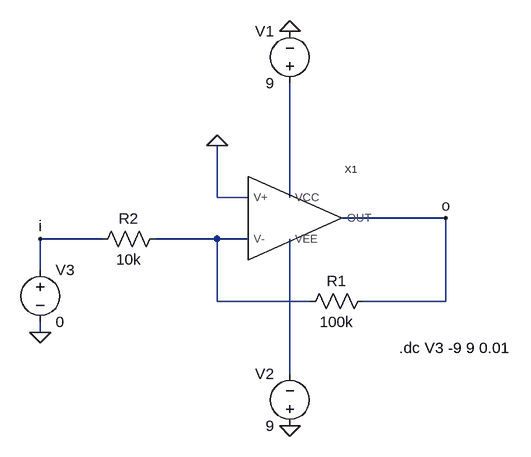
[diagram p0: schematic Output_Swing.asc]
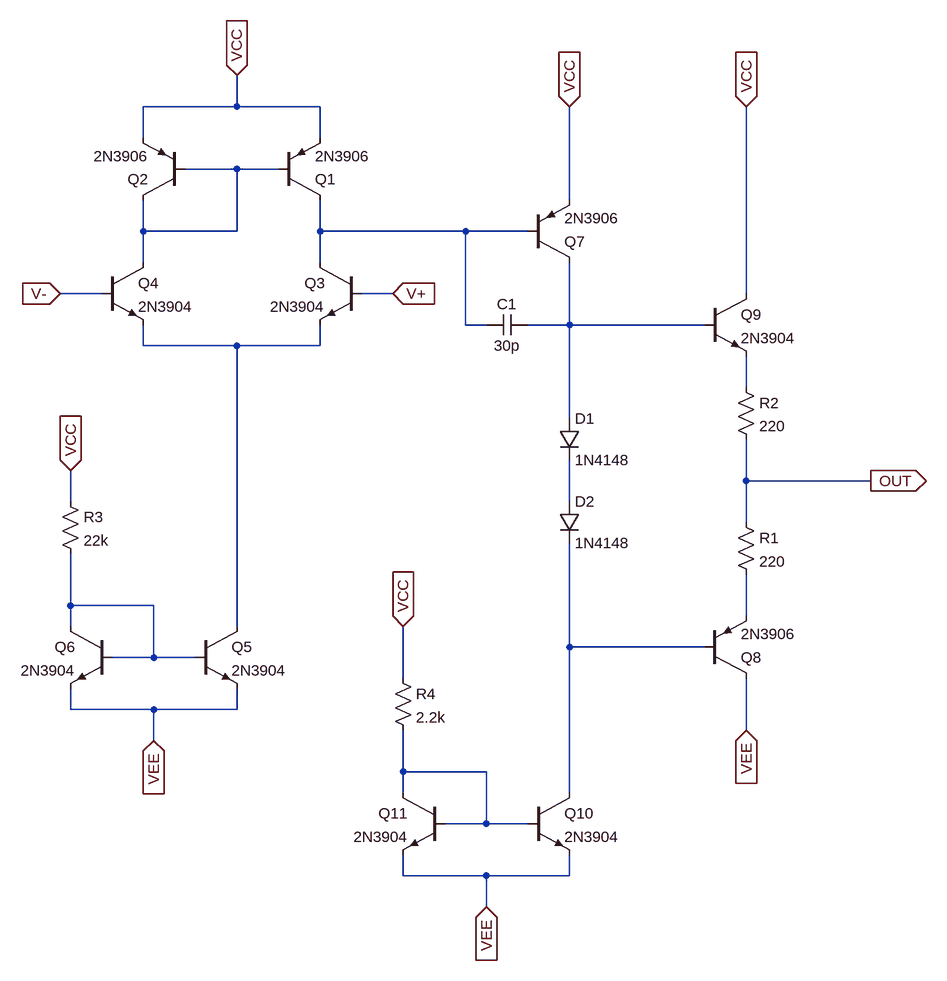
[diagram p1: sub-circuit giug_amp_301.asc]
Output_Swing.asc, the LTspice schematic file:
Version 4
SHEET 1 880 680
WIRE 128 112 128 32
WIRE 176 112 128 112
WIRE 240 112 240 -64
WIRE 480 144 320 144
WIRE -48 176 -144 176
WIRE 128 176 32 176
WIRE 176 176 128 176
WIRE -144 224 -144 176
WIRE 128 272 128 176
WIRE 272 272 128 272
WIRE 480 272 480 144
WIRE 480 272 352 272
WIRE -144 320 -144 304
WIRE 240 384 240 176
FLAG 240 464 0
FLAG 240 -144 0
FLAG 128 32 0
FLAG -144 320 0
FLAG -144 176 i
FLAG 480 144 o
SYMBOL Giug_Amp_301 240 144 R0
SYMATTR InstName X1
SYMBOL voltage 240 -48 R180
WINDOW 0 24 96 Left 2
WINDOW 3 24 16 Left 2
WINDOW 123 0 0 Left 0
WINDOW 39 0 0 Left 0
SYMATTR InstName V1
SYMATTR Value 9
SYMBOL voltage 240 480 R180
WINDOW 0 24 96 Left 2
WINDOW 3 24 16 Left 2
WINDOW 123 0 0 Left 0
WINDOW 39 0 0 Left 0
SYMATTR InstName V2
SYMATTR Value 9
SYMBOL res 256 288 R270
WINDOW 0 32 56 VTop 2
WINDOW 3 0 56 VBottom 2
SYMATTR InstName R1
SYMATTR Value 100k
SYMBOL res 48 160 R90
WINDOW 0 0 56 VBottom 2
WINDOW 3 32 56 VTop 2
SYMATTR InstName R2
SYMATTR Value 10k
SYMBOL voltage -144 208 R0
WINDOW 123 0 0 Left 0
WINDOW 39 0 0 Left 0
SYMATTR InstName V3
SYMATTR Value 0
TEXT 408 344 Left 2 !.dc V3 -9 9 0.01

giug_amp_301.asc, the sub-circuit schematic file:
Version 4
SHEET 1 1704 1368
WIRE 160 32 160 -16
WIRE 160 32 16 32
WIRE 288 32 160 32
WIRE 16 80 16 32
WIRE 288 80 288 32
WIRE 160 128 80 128
WIRE 224 128 160 128
WIRE 672 176 672 32
WIRE 16 224 16 176
WIRE 160 224 160 128
WIRE 160 224 16 224
WIRE 288 224 288 176
WIRE 512 224 288 224
WIRE 608 224 512 224
WIRE 16 272 16 224
WIRE 288 272 288 224
WIRE -48 320 -112 320
WIRE 400 320 352 320
WIRE 944 320 944 32
WIRE 512 368 512 224
WIRE 544 368 512 368
WIRE 672 368 672 272
WIRE 672 368 608 368
WIRE 880 368 672 368
WIRE 16 400 16 368
WIRE 160 400 16 400
WIRE 288 400 288 368
WIRE 288 400 160 400
WIRE 944 464 944 416
WIRE 672 512 672 368
WIRE 944 608 944 544
WIRE 1136 608 944 608
WIRE -96 640 -96 592
WIRE 672 640 672 576
WIRE 944 672 944 608
WIRE -96 800 -96 720
WIRE 32 800 -96 800
WIRE 944 816 944 752
WIRE -96 832 -96 800
WIRE 160 832 160 400
WIRE 672 864 672 704
WIRE 880 864 672 864
WIRE 32 880 32 800
WIRE 32 880 -32 880
WIRE 96 880 32 880
WIRE 416 912 416 832
WIRE -96 960 -96 928
WIRE 32 960 -96 960
WIRE 160 960 160 928
WIRE 160 960 32 960
WIRE 944 992 944 912
WIRE 32 1008 32 960
WIRE 416 1056 416 992
WIRE 544 1056 416 1056
WIRE 416 1088 416 1056
WIRE 672 1088 672 864
WIRE 544 1136 544 1056
WIRE 544 1136 480 1136
WIRE 608 1136 544 1136
WIRE 416 1216 416 1184
WIRE 544 1216 416 1216
WIRE 672 1216 672 1184
WIRE 672 1216 544 1216
WIRE 544 1264 544 1216
FLAG 32 1008 VEE
IOPIN 32 1008 In
FLAG 160 -16 VCC
IOPIN 160 -16 In
FLAG 672 32 VCC
IOPIN 672 32 In
FLAG 400 320 V+
IOPIN 400 320 In
FLAG 1136 608 OUT
IOPIN 1136 608 Out
FLAG 944 992 VEE
IOPIN 944 992 In
FLAG 944 32 VCC
IOPIN 944 32 In
FLAG -96 592 VCC
IOPIN -96 592 In
FLAG 544 1264 VEE
IOPIN 544 1264 In
FLAG 416 832 VCC
IOPIN 416 832 In
FLAG -112 320 V-
IOPIN -112 320 In
SYMBOL pnp 224 176 M180
SYMATTR InstName Q1
SYMATTR Value 2N3906
SYMBOL pnp 80 176 R180
SYMATTR InstName Q2
SYMATTR Value 2N3906
SYMBOL npn 352 272 M0
SYMATTR InstName Q3
SYMATTR Value 2N3904
SYMBOL npn -48 272 R0
SYMATTR InstName Q4
SYMATTR Value 2N3904
SYMBOL npn 96 832 R0
SYMATTR InstName Q5
SYMATTR Value 2N3904
SYMBOL npn -32 832 M0
SYMATTR InstName Q6
SYMATTR Value 2N3904
SYMBOL pnp 608 272 M180
SYMATTR InstName Q7
SYMATTR Value 2N3906
SYMBOL cap 544 384 R270
WINDOW 0 32 32 VTop 2
WINDOW 3 0 32 VBottom 2
SYMATTR InstName C1
SYMATTR Value 30p
SYMBOL diode 656 512 R0
SYMATTR InstName D1
SYMATTR Value 1N4148
SYMBOL diode 656 640 R0
SYMATTR InstName D2
SYMATTR Value 1N4148
SYMBOL pnp 880 912 M180
SYMATTR InstName Q8
SYMATTR Value 2N3906
SYMBOL res 928 656 R0
SYMATTR InstName R1
SYMATTR Value 220
SYMBOL res 928 448 R0
SYMATTR InstName R2
SYMATTR Value 220
SYMBOL npn 880 320 R0
SYMATTR InstName Q9
SYMATTR Value 2N3904
SYMBOL res -112 624 R0
SYMATTR InstName R3
SYMATTR Value 22k
SYMBOL npn 608 1088 R0
SYMATTR InstName Q10
SYMATTR Value 2N3904
SYMBOL npn 480 1088 M0
SYMATTR InstName Q11
SYMATTR Value 2N3904
SYMBOL res 400 896 R0
SYMATTR InstName R4
SYMATTR Value 2.2k

The netlist it stands for:
* Output_Swing.asc
XX1 0 N002 o N001 N003 giug_amp_301
V1 N001 0 9
V2 0 N003 9
R1 N002 o 100k
R2 N002 i 10k
V3 i 0 0

* block symbol definitions
.subckt giug_amp_301 V+ V- OUT VCC VEE
Q1 N002 N001 VCC 0 2N3906
Q2 N001 N001 VCC 0 2N3906
Q3 N002 V+ N004 0 2N3904
Q4 N001 V- N004 0 2N3904
Q5 N004 N007 VEE 0 2N3904
Q6 N007 N007 VEE 0 2N3904
Q7 N003 N002 VCC 0 2N3906
C1 N002 N003 30p
D1 N003 N006 1N4148
D2 N006 N009 1N4148
Q8 VEE N009 N008 0 2N3906
R1 OUT N008 220
R2 N005 OUT 220
Q9 VCC N003 N005 0 2N3904
R3 VCC N007 22k
Q10 N009 N010 VEE 0 2N3904
Q11 N010 N010 VEE 0 2N3904
R4 VCC N010 2.2k
.ends giug_amp_301

.model D D
.lib standard.dio
.model NPN NPN
.model PNP PNP
.lib standard.bjt
.dc V3 -9 9 0.01
.backanno
.end